# EAGLE design DS1077_breakout (EAGLE 6.4)
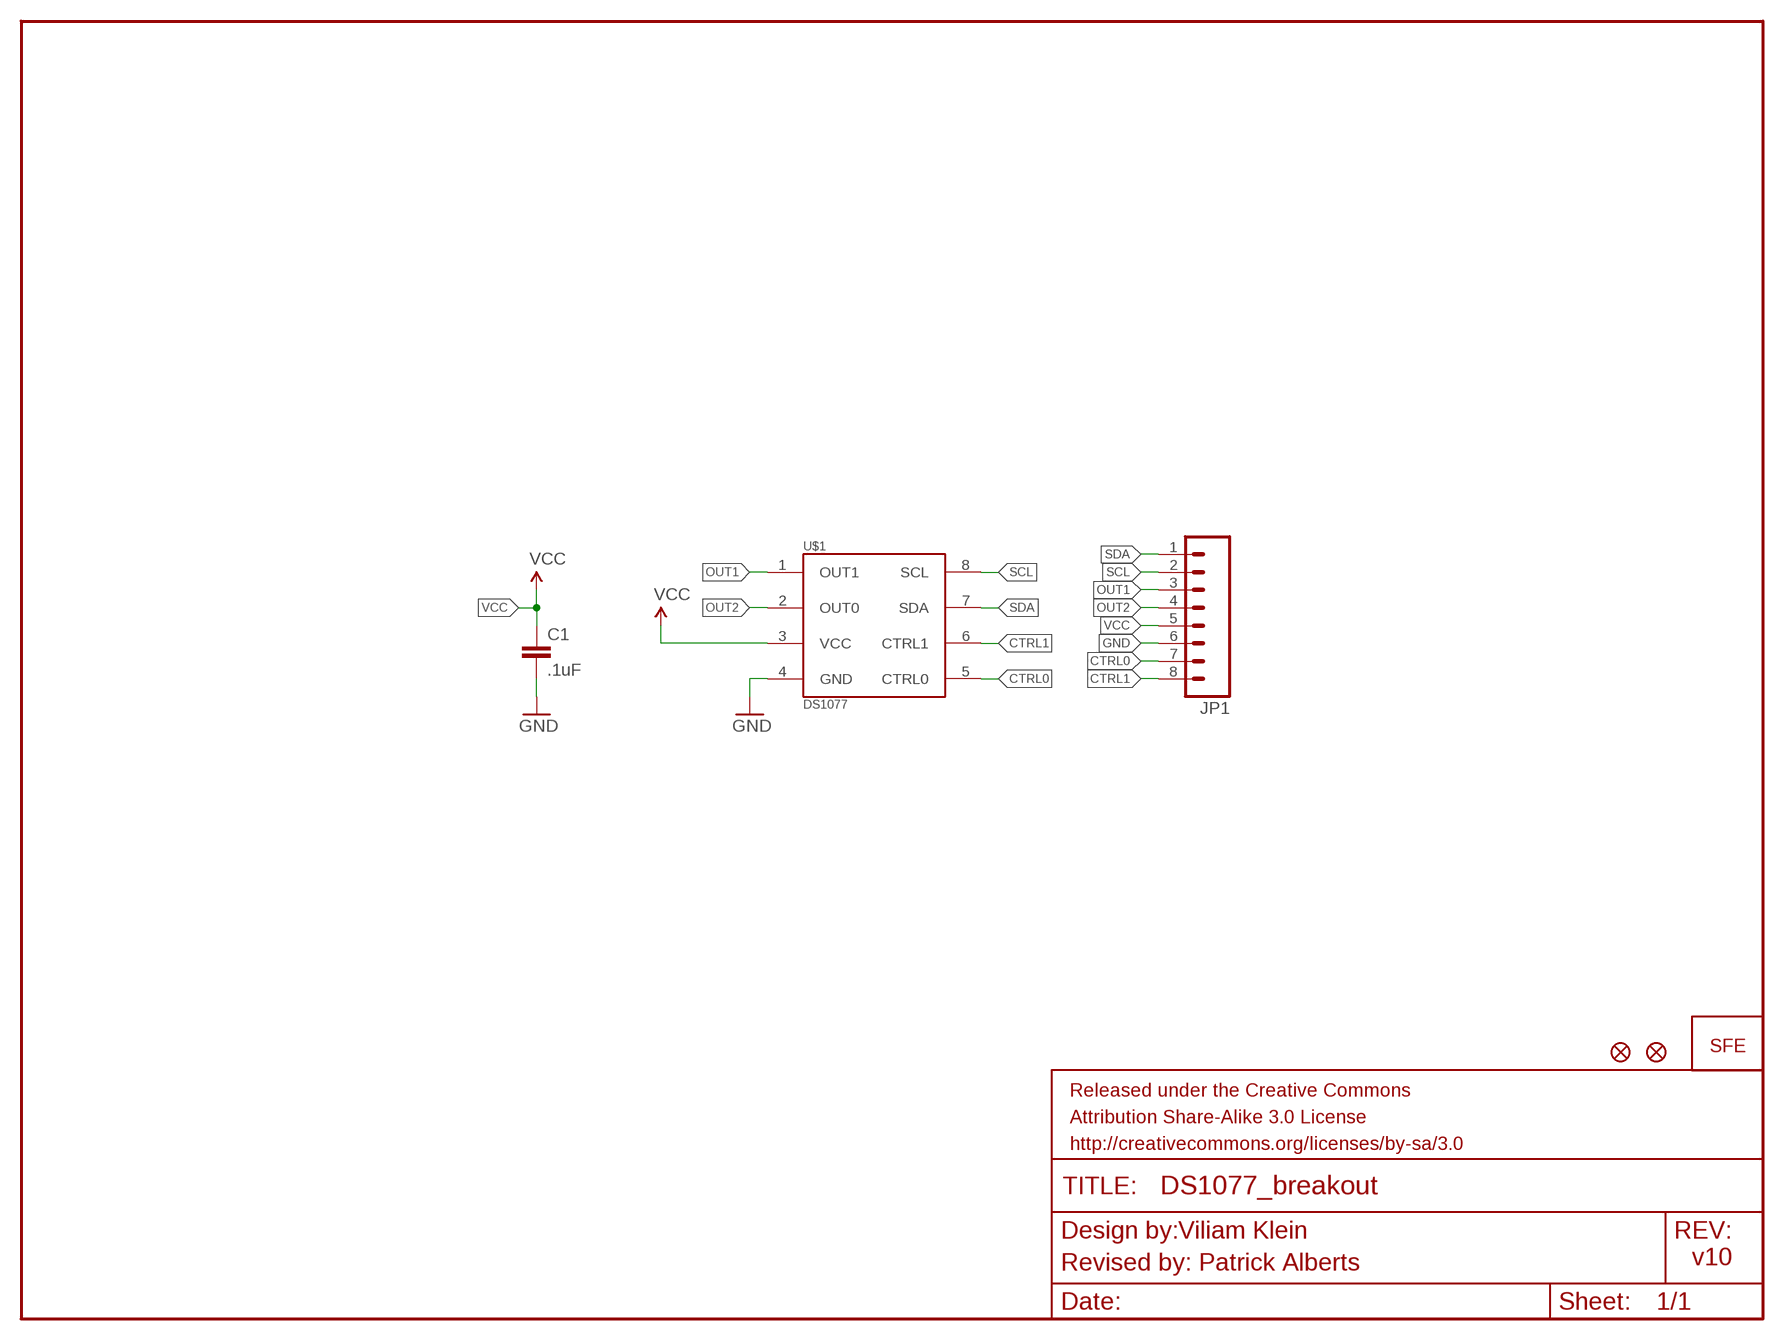
[diagram p0: schematic, sheet 1]

## Parts
C1  .1uF  CAP0603  [0603]
FRAME1  FRAME-LETTER  [CREATIVE_COMMONS]
JP1  M081X08  [1X08]
U$1  DS1077  [SO08]
U$2  LOGO-SFESK  [SFE-LOGO-FLAME]
U$3  FIDUCIAL1X2  [FIDUCIAL-1X2]
U$4  FIDUCIAL1X2  [FIDUCIAL-1X2]

## Nets
CTRL0: JP1.7 U$1.5(CTRL0)
CTRL1: JP1.8 U$1.6(CTRL1)
GND: C1.2 JP1.6 U$1.4(GND)
OUT1: JP1.3 U$1.1(OUT1)
OUT2: JP1.4 U$1.2(OUT0)
SCL: JP1.2 U$1.8(SCL)
SDA: JP1.1 U$1.7(SDA)
VCC: C1.1 JP1.5 U$1.3(VCC)

## Notes on the sheet
- Viliam Klein
- Revised by: Patrick Alberts | v10

## Library data of the parts
C1 = SparkFun:CAP: Capacitor Standard 0603 ceramic capacitor, and 0.1" leaded capacitor.
FRAME1 = SparkFun-Aesthetics:FRAME-LETTER: Schematic Frame Standard 8.5x11 US Letter frame
JP1 = SparkFun-Connectors:M08: Header 8 Standard 8-pin 0.1" header. Use with straight break away headers (SKU : PRT-00116), right angle break away headers (PRT-00553), swiss pins (PRT-00743), machine pins (PRT-00117), and female headers (PRT-00115).
U$1 = SparkFun:DS1077
U$2 = SparkFun:LOGO-SFE: Spark Fun Electronics PCB Logo This is the standard Spark Fun Electronics PCB logo.
U$3 U$4 = SparkFun:FIDUCIAL: Fiducial Alignment Points Various fiducial points for machine vision alignment.

## Board
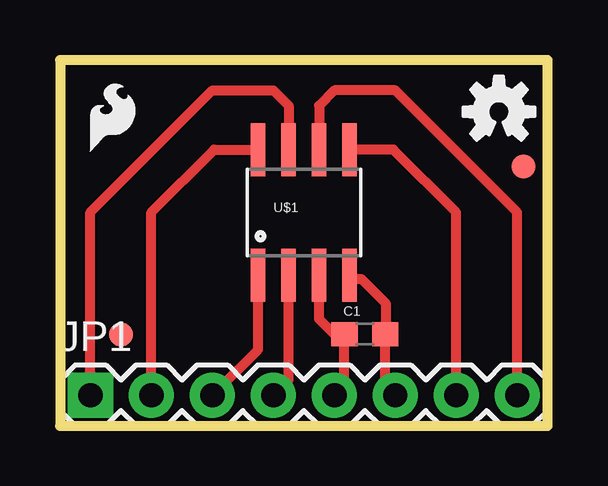
[diagram p1: board, top side]
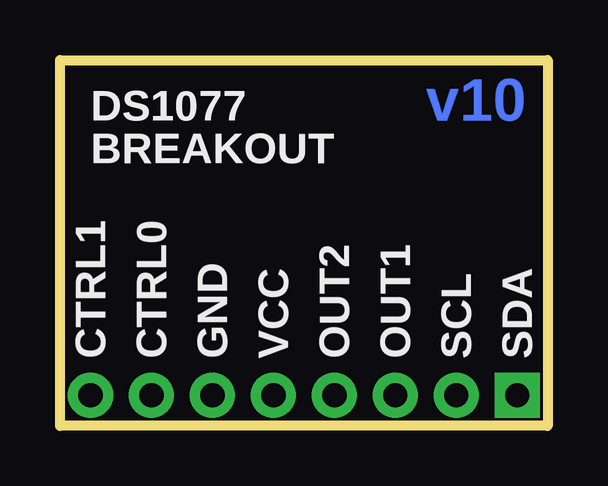
[diagram p2: board, bottom side, seen from below]

Size 20.32 x 15.24 mm. Coordinates in mm from the lower left corner, seen from the top.
Outline: 0,0 20.32,0 20.32,15.24 0,15.24 0,0
Copper layers (1*16): Top 0.035mm / dielectric 1.5mm / Bottom 0.035mm
Design rules "SparkFun": minimum track width 8mil, minimum drill 20mil, track to track 8mil, track to pad 8mil, pad to pad 8mil, via to via 8mil, smd to smd 8mil, copper to edge 10mil, drill to drill 8mil, minimum pad ring 12mil, minimum via ring 10mil, stop-mask expansion 4mil, vias tented up to drill 25mil, thermal gap 10mil

### Footprints (pad centres in the part's own frame; a part is rotated, then mirrored left to right if it is on the bottom)
0603 = smd 1.1 x 1: 1 -0.85,0; 2 0.85,0
1X08 = drill 1.016 pad 1.88 square: 1 0,0 | drill 1.016 pad 1.88: 2 2.54,0; 3 5.08,0; 4 7.62,0; 5 10.16,0; 6 12.7,0; 7 15.24,0; 8 17.78,0
SO08 = smd 0.61 x 2.21: 1 -1.905,-2.616; 2 -0.635,-2.616; 3 0.635,-2.616; 4 1.905,-2.616; 5 1.905,2.616; 6 0.635,2.616; 7 -0.635,2.616; 8 -1.905,2.616
FIDUCIAL-1X2 = smd 1 x 1: 1 0,0

### Placement (x,y rotation side)
C1  12.7,3.81 0 top
FRAME1  -65.25,0 0 top  (outside the outline)
JP1  1.27,1.27 0 top
U$1  10.16,8.89 0 top
U$2  1.27,11.43 0 top
U$3  19.3,10.79 0 top
U$4  2.54,3.81 0 top
U$5  [OSHW-LOGO-S]  18.29,13.08 0 top

### Tracks (layer width: path | path; a pad name or v marks a point on that pad's centre or on a via)
CTRL0
  Top 0.406: U$1.5 13.89,11.51 16.51,8.89 JP1.7
CTRL1
  Top 0.406: U$1.6 10.79,13.34 11.43,13.97 13.97,13.97 19.05,8.89 JP1.8
GND
  Top 0.254: 13.59,3.68 13.55,3.72 C1.2 | JP1.6 13.97,1.14
  Top 0.406: 13.59,3.68 13.59,5.08 12.57,6.1 12.06,6.1 U$1.4 | C1.2 13.55,1.56 13.97,1.14
OUT1
  Top 0.406: U$1.1 8.26,3.17 JP1.3
OUT2
  Top 0.406: U$1.2 9.53,1.91 JP1.4
SCL
  Top 0.406: U$1.8 6.43,11.51 3.81,8.89 JP1.2
SDA
  Top 0.406: U$1.7 9.53,13.34 8.89,13.97 6.35,13.97 1.27,8.89 JP1.1
VCC
  Top 0.406: U$1.3 10.79,4.45 11.43,3.81 C1.1 11.85,1.69 JP1.5

### Text on the board
Bottom: v10
bPlace: DS1077 | BREAKOUT | SDA | SCL | OUT1 | OUT2 | VCC | GND | CTRL0 | CTRL1
tDocu: Viliam Klein | Revised by: Patrick Alberts